# EAGLE design max1749-breakout (EAGLE 9.6.2)
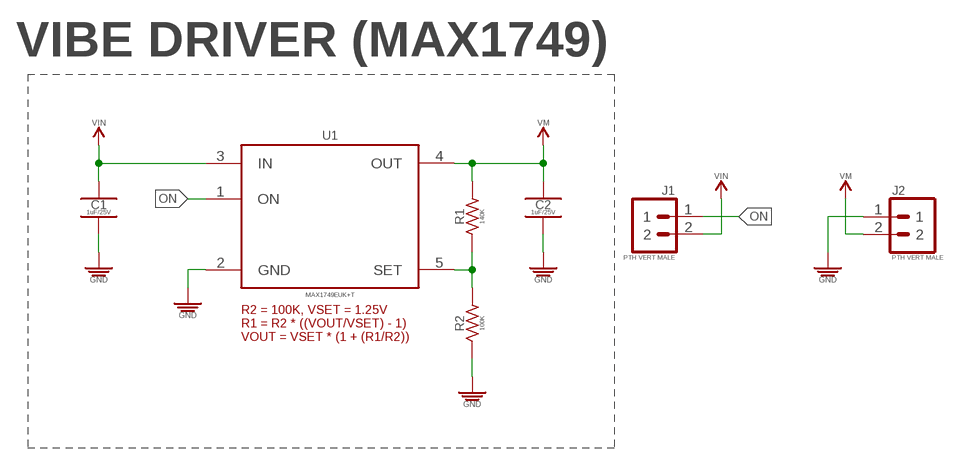
[diagram p0: schematic, sheet 1]

## Parts
C1  1uF/25V  1UF_CER_SMD-0402_25V-10%  [CAPC1005X55_SMD-0402]
C2  1uF/25V  1UF_CER_SMD-0402_25V-10%  [CAPC1005X55_SMD-0402]
J1  PTH VERT MALE  1X02_PTH_VERT_MALE_2.54MM  [HDRV2W64P254_1X2_508X254X838B]
J2  PTH VERT MALE  1X02_PTH_VERT_MALE_2.54MM  [HDRV2W64P254_1X2_508X254X838B]
R1  140K  140KΩ_SMD-0402_1/16W-1%  [RESC1005X35_SMD-0402]
R2  100K  100KΩ_SMD-0402_1/16W_5%  [RESC1005X35_SMD-0402]
U1  MAX1749EUK+T  MAX1749_MAX1749EUK-T  [SOT95P280X117-5N]

## Nets
GND: C1.2 C2.2 J2.1 R2.1 U1.2(GND)
N$1: R1.1 R2.2 U1.5(SET)
ON: J1.1 U1.1(ON)
VIN: C1.1 J1.2 U1.3(IN)
VM: C2.1 J2.2 R1.2 U1.4(OUT)

## Notes on the sheet
- VIBE DRIVER (MAX1749)

## Library data of the parts
C1 C2 = _capacitors:1UF; DATASHEET: https://product.tdk.com/info/en/catalog/datasheets/mlcc_commercial_lowprofile_en.pdf; DIST: Digikey; DISTLINK: https://www.digikey.com/products/en?keywords=445-13185-1-ND; DISTPN: 445-13185-1-ND; MFR: TDK Corporation; MPN: CGB2A1X5R1E105K033BC
J1 J2 = _connectors:1X02: 2 Positions Header Connector 0.079" (2.00mm) Through Hole Tin; DATASHEET: https://drawings-pdf.s3.amazonaws.com/C10436.pdf; DIST: Digikey; DISTLINK: https://www.digikey.com/products/en?keywords=S1012E-02-ND; DISTPN: S1012E-02-ND; MFR: Sullins Connector Solutions; MPN: PEC02SAAN
R1 = _resistors:140KΩ; DATASHEET: https://www.yageo.com/upload/media/product/productsearch/datasheet/rchip/PYu-RC_Group_51_RoHS_L_11.pdf; DIST: Digikey; DISTLINK: https://www.digikey.com/en/products/detail/yageo/RC0402FR-07140KL/5280838?s=N4IgTCBcDaIJoEEDiYCcB2AHAYQCoFoA5AERAF0BfIA; DISTPN: YAG2978CT-ND; MFR: Yageo; MPN: RC0402FR-07140KL
R2 = _resistors:100KΩ; DATASHEET: http://www.yageo.com/documents/recent/PYu-RC_Group_51_RoHS_L_9.pdf; DIST: Digikey; DISTLINK: https://www.digikey.com/products/en?keywords=311-100KJRCT-ND; DISTPN: 311-100KJRCT-ND; MFR: Yageo; MPN: RC0402JR-07100KL
U1 = _motor_drivers:MAX1749: IC MOTOR DRVR 2.5V-6.5V SOT23-5 Motor Driver PMOS SOT-23-5; DATASHEET: https://datasheets.maximintegrated.com/en/ds/MAX1749.pdf; DIST: Digikey; DISTLINK: https://www.digikey.com/en/products/detail/maxim-integrated/MAX1749EUK-T/1517860?s=N4IgTCBcDaILIEEAaBGA7AFgJwFECqA0gNQAqAwiQLQByAIiALoC%2BQA; DISTPN: MAX1749EUK+TCT-ND; MFR: Maxim Integrated; MPN: MAX1749EUK+T

## Board
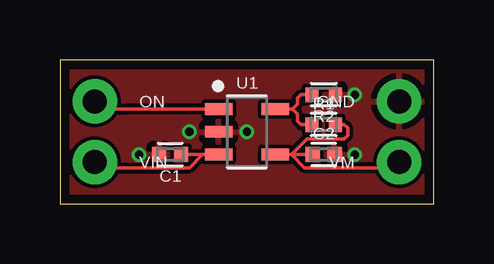
[diagram p1: board, top side]
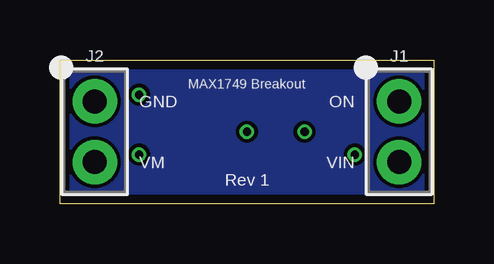
[diagram p2: board, bottom side, seen from below]

Size 15.6 x 6 mm. Coordinates in mm from the lower left corner, seen from the top.
Outline: 0,0 15.6,0 15.6,6 0,6 0,0
Copper layers (1*16): Top 0.035559375mm / dielectric 1.6mm / Bottom 0.035559375mm
Design rules "oshpark-2layer": minimum track width 6mil, minimum drill 10mil, track to track 6mil, track to pad 6mil, pad to pad 6mil, via to via 6mil, smd to smd 6mil, copper to edge 15mil, drill to drill 6mil, minimum pad ring 5mil, minimum via ring 5mil, stop-mask expansion 2.5mil, vias tented up to drill 0mil, thermal gap 10mil

### Footprints (pad centres in the part's own frame; a part is rotated, then mirrored left to right if it is on the bottom)
CAPC1005X55_SMD-0402 = smd 0.585 x 0.612: 1 -0.458,0; 2 0.458,0
HDRV2W64P254_1X2_508X254X838B = drill 1 pad 1.85: 1 -1.27,0; 2 1.27,0
RESC1005X35_SMD-0402 = smd 0.535 x 0.6: 1 -0.482,0; 2 0.482,0
SOT95P280X117-5N = smd 1.14 x 0.485: 1 -1.18,0.95; 2 -1.18,0; 3 -1.18,-0.95; 4 1.18,-0.95; 5 1.18,0.95

### Placement (x,y rotation side)
C1  4.6,2.05 180 top
C2  11,2.05 0 top
J1  1.45,3 270 bottom
J2  14.15,3 270 bottom
R1  11,3.3 0 top
R2  11,4.55 180 top
U1  7.8,3 0 top

### Tracks (layer width: path | path; a pad name or v marks a point on that pad's centre or on a via)
GND  (via drill 0.35 pad 0.15)
  other vias: 7.8,3 5.4,3 12.3,2.05 12.3,4.55 3.3,2.05
  pour Top: 0,0 15.6,0 15.6,6 0,6
N$1
  Top 0.152: R1.1 10.05,3.3 9.9,3.45 9.9,3.75 9.7,3.95 | R2.2 10.05,4.55 9.9,4.4 9.9,4.15 9.7,3.95 | U1.5 9.7,3.95
ON
  Top 0.152: U1.1 3.1,3.95 2.8,3.95 1.77,3.95 J1.1
VIN
  Top 0.152: U1.3 5.95,2.05 | 5.95,2.05 5.4,1.5 1.68,1.5 J1.2 | C1.1 5.95,2.05
VLED
  pour Bottom: 0,0 15.6,0 15.6,6 0,6
VM
  Top 0.152: C2.1 9.65,2.05 | U1.4 9.65,2.05 | 9.65,2.05 10.2,1.5 13.92,1.5 J2.2 | R1.2 11.85,3.3 12,3.15 12,2.85 11.85,2.7 10.3,2.7 9.65,2.05

### Text on the board
tPlace: ON | GND | VIN | VM
bPlace: MAX1749 Breakout | ON | GND | VIN | VM | Rev 1